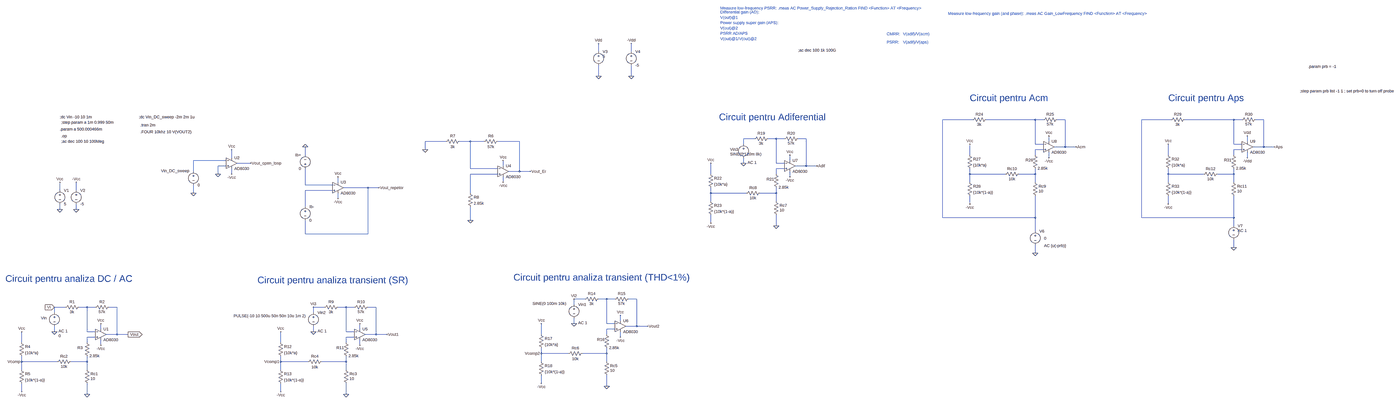
[diagram p0: schematic etaj1_.asc, whole sheet]
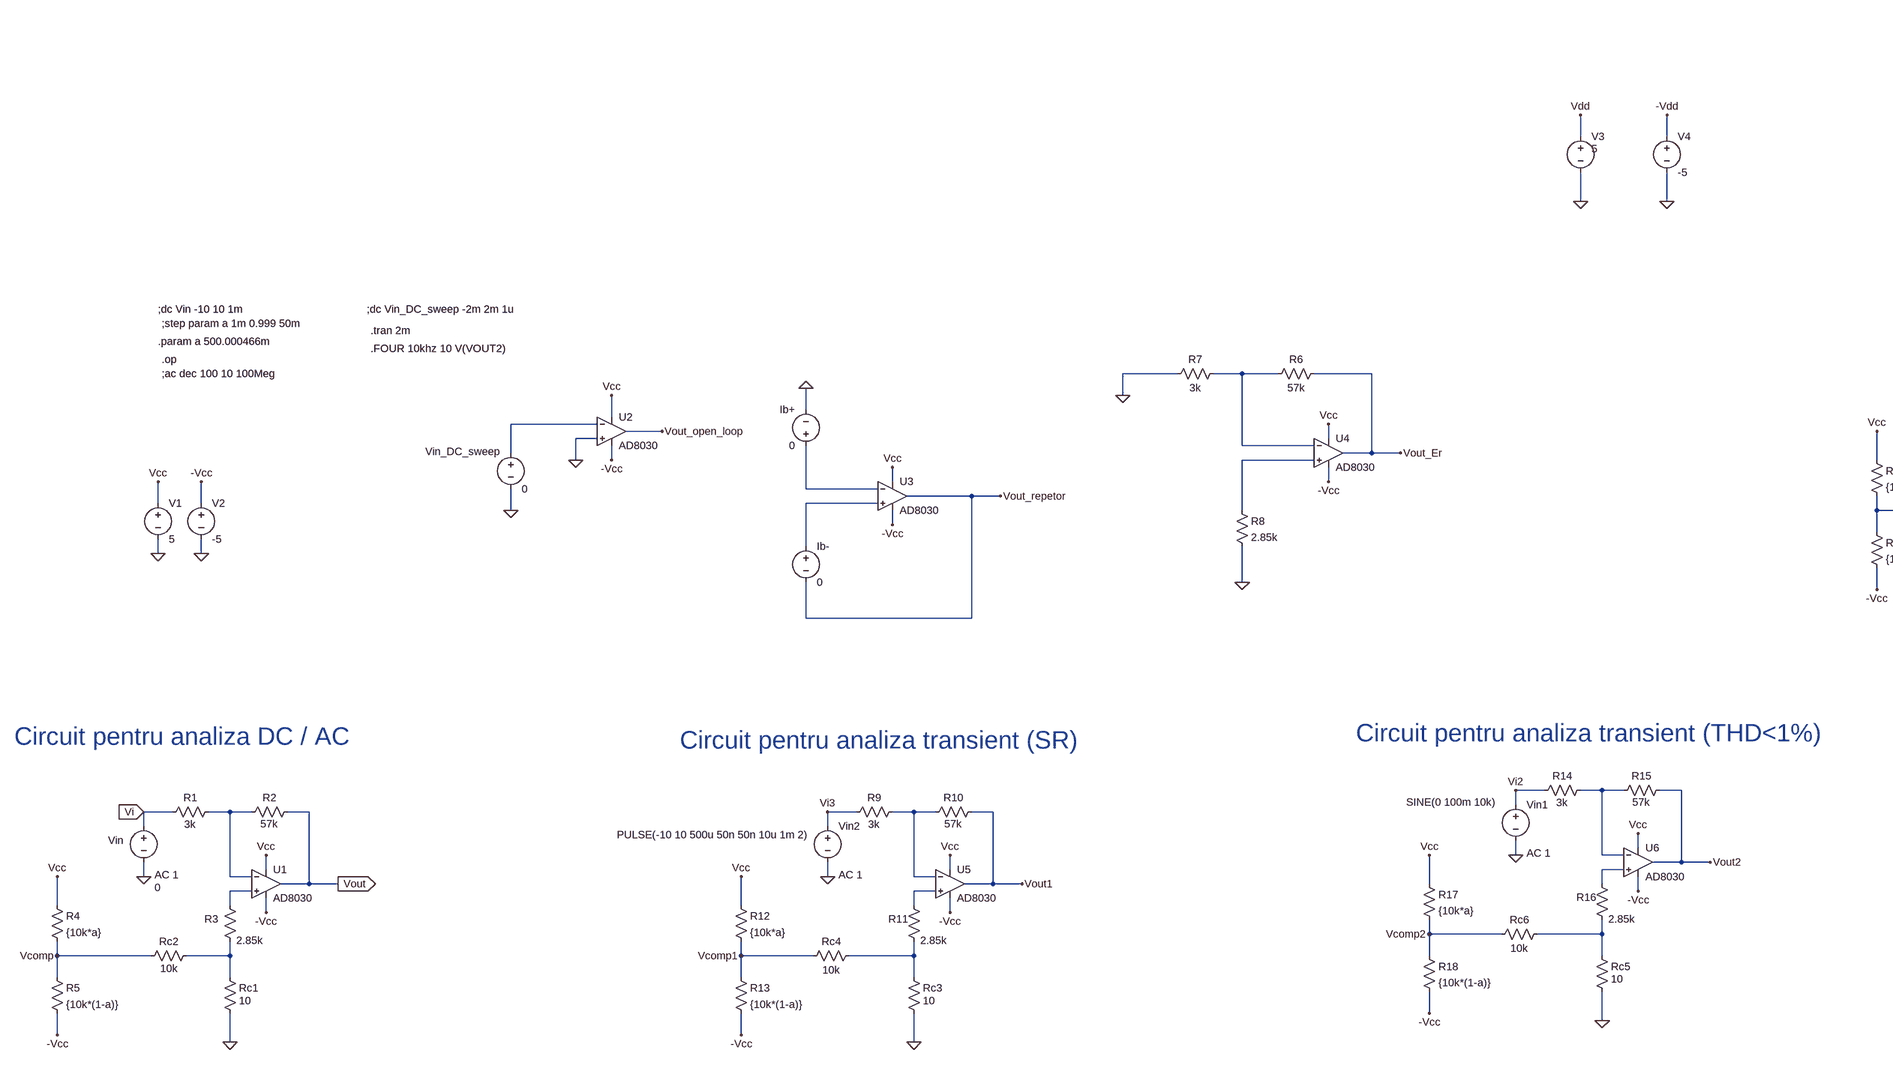
[diagram p1: schematic etaj1_.asc, part, row 1 of 1, column 1 of 2]
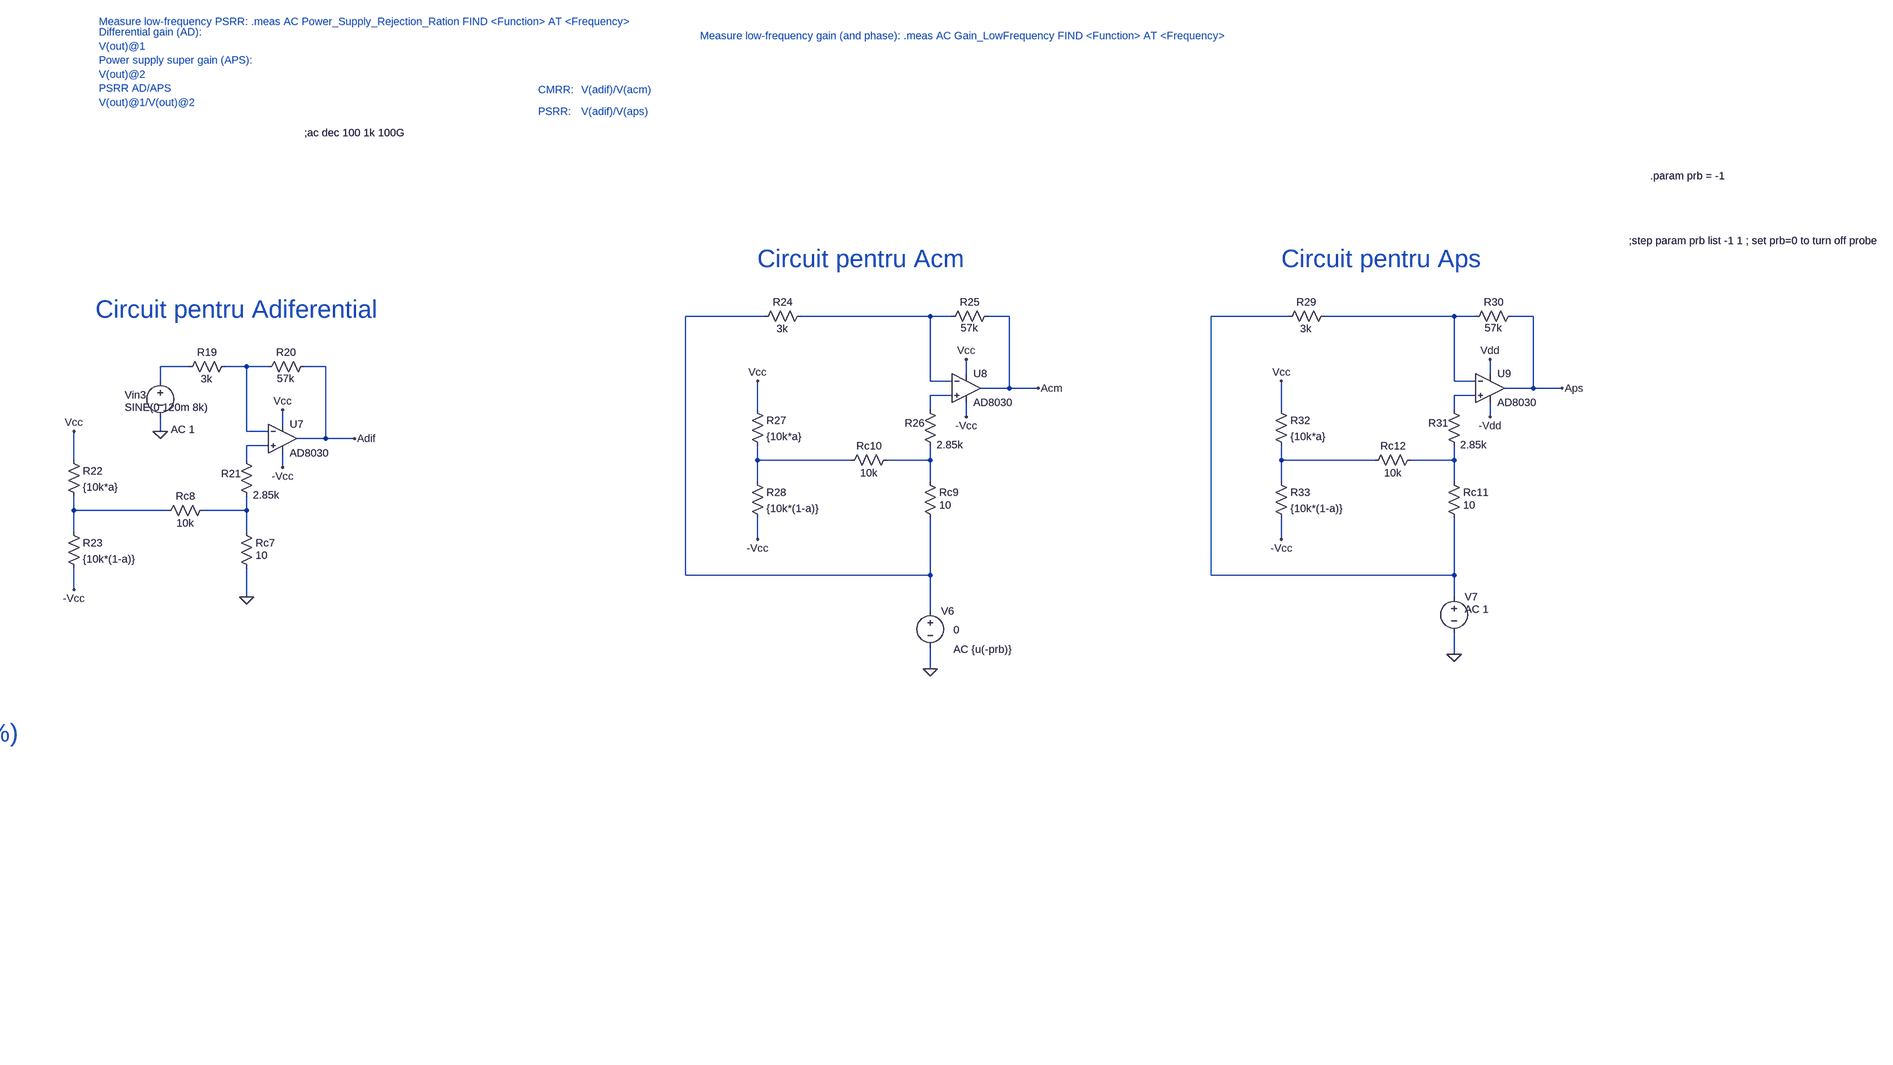
[diagram p2: schematic etaj1_.asc, part, row 1 of 1, column 2 of 2]
etaj1_.asc, the LTspice schematic file:
Version 4
SHEET 1 6668 1776
WIRE 1664 -1232 1664 -1280
WIRE 1856 -1232 1856 -1280
WIRE 1664 -1088 1664 -1152
WIRE 1856 -1088 1856 -1152
WIRE 3872 -832 3696 -832
WIRE 4240 -832 3952 -832
WIRE 4288 -832 4240 -832
WIRE 4416 -832 4368 -832
WIRE 5200 -832 4864 -832
WIRE 5568 -832 5280 -832
WIRE 5616 -832 5568 -832
WIRE 5744 -832 5696 -832
WIRE 2592 -720 2528 -720
WIRE 2720 -720 2672 -720
WIRE 2768 -720 2720 -720
WIRE 2896 -720 2848 -720
WIRE 768 -704 640 -704
WIRE 912 -704 848 -704
WIRE 992 -704 912 -704
WIRE 1200 -704 1072 -704
WIRE 4320 -704 4320 -736
WIRE 5648 -704 5648 -736
WIRE 2528 -688 2528 -720
WIRE 4240 -688 4240 -832
WIRE 4288 -688 4240 -688
WIRE 5568 -688 5568 -832
WIRE 5616 -688 5568 -688
WIRE 4416 -672 4416 -832
WIRE 4416 -672 4352 -672
WIRE 4480 -672 4416 -672
WIRE 5744 -672 5744 -832
WIRE 5744 -672 5680 -672
WIRE 5808 -672 5744 -672
WIRE 640 -656 640 -704
WIRE 4288 -656 4240 -656
WIRE 5616 -656 5568 -656
WIRE -64 -624 -64 -672
WIRE 3856 -624 3856 -688
WIRE 4240 -624 4240 -656
WIRE 5184 -624 5184 -688
WIRE 5568 -624 5568 -656
WIRE -496 -608 -496 -656
WIRE 4320 -608 4320 -640
WIRE 5648 -608 5648 -640
WIRE -528 -592 -720 -592
WIRE 2800 -592 2800 -624
WIRE -384 -576 -464 -576
WIRE 2528 -576 2528 -608
WIRE 2720 -576 2720 -720
WIRE 2768 -576 2720 -576
WIRE -528 -560 -576 -560
WIRE 1104 -560 1104 -592
WIRE 2896 -560 2896 -720
WIRE 2896 -560 2832 -560
WIRE 2960 -560 2896 -560
WIRE 912 -544 912 -704
WIRE 1072 -544 912 -544
WIRE 2768 -544 2720 -544
WIRE -720 -528 -720 -592
WIRE 1200 -528 1200 -704
WIRE 1200 -528 1136 -528
WIRE 1264 -528 1200 -528
WIRE -576 -512 -576 -560
WIRE -496 -512 -496 -544
WIRE 1072 -512 912 -512
WIRE 2336 -512 2336 -576
WIRE 2720 -512 2720 -544
WIRE 3856 -512 3856 -544
WIRE 4064 -512 3856 -512
WIRE 4240 -512 4240 -544
WIRE 4240 -512 4144 -512
WIRE 5184 -512 5184 -544
WIRE 5392 -512 5184 -512
WIRE 5568 -512 5568 -544
WIRE 5568 -512 5472 -512
WIRE 2800 -496 2800 -528
WIRE 128 -464 128 -496
WIRE 1104 -464 1104 -496
WIRE 3856 -464 3856 -512
WIRE 4240 -464 4240 -512
WIRE 5184 -464 5184 -512
WIRE 5568 -464 5568 -512
WIRE -64 -448 -64 -544
WIRE 96 -448 -64 -448
WIRE 304 -432 160 -432
WIRE 368 -432 304 -432
WIRE -1504 -416 -1504 -464
WIRE -1408 -416 -1408 -464
WIRE 96 -416 -64 -416
WIRE -720 -400 -720 -448
WIRE 912 -400 912 -512
WIRE 2336 -400 2336 -432
WIRE 2544 -400 2336 -400
WIRE 2720 -400 2720 -432
WIRE 2720 -400 2624 -400
WIRE 128 -368 128 -400
WIRE 2336 -352 2336 -400
WIRE 2720 -352 2720 -400
WIRE 3856 -336 3856 -384
WIRE 5184 -336 5184 -384
WIRE -64 -320 -64 -416
WIRE -1504 -304 -1504 -336
WIRE -1408 -304 -1408 -336
WIRE 3696 -256 3696 -832
WIRE 4240 -256 4240 -384
WIRE 4240 -256 3696 -256
WIRE 4864 -256 4864 -832
WIRE 5568 -256 5568 -384
WIRE 5568 -256 4864 -256
WIRE 912 -240 912 -320
WIRE 2336 -224 2336 -272
WIRE 2720 -208 2720 -272
WIRE 5568 -208 5568 -256
WIRE 4240 -176 4240 -256
WIRE -64 -160 -64 -240
WIRE 304 -160 304 -432
WIRE 304 -160 -64 -160
WIRE 5568 -80 5568 -128
WIRE 4240 -48 4240 -96
WIRE 1584 256 1520 256
WIRE 1712 256 1664 256
WIRE 1760 256 1712 256
WIRE 1888 256 1840 256
WIRE 1520 288 1520 256
WIRE -1472 304 -1536 304
WIRE -1344 304 -1392 304
WIRE -1296 304 -1344 304
WIRE -1168 304 -1216 304
WIRE 48 304 -16 304
WIRE 176 304 128 304
WIRE 224 304 176 304
WIRE 352 304 304 304
WIRE -1536 336 -1536 304
WIRE -16 336 -16 304
WIRE 1792 384 1792 352
WIRE 1520 400 1520 368
WIRE 1712 400 1712 256
WIRE 1760 400 1712 400
WIRE 1888 416 1888 256
WIRE 1888 416 1824 416
WIRE 1952 416 1888 416
WIRE -1264 432 -1264 400
WIRE 256 432 256 400
WIRE 1760 432 1712 432
WIRE -1536 448 -1536 416
WIRE -1344 448 -1344 304
WIRE -1296 448 -1344 448
WIRE -16 448 -16 416
WIRE 176 448 176 304
WIRE 224 448 176 448
WIRE -1168 464 -1168 304
WIRE -1168 464 -1232 464
WIRE -1104 464 -1168 464
WIRE 352 464 352 304
WIRE 352 464 288 464
WIRE 416 464 352 464
WIRE 1328 464 1328 400
WIRE 1712 464 1712 432
WIRE -1296 480 -1344 480
WIRE 224 480 176 480
WIRE 1792 480 1792 448
WIRE -1728 512 -1728 448
WIRE -1344 512 -1344 480
WIRE -208 512 -208 448
WIRE 176 512 176 480
WIRE -1264 528 -1264 496
WIRE 256 528 256 496
WIRE 1328 576 1328 544
WIRE 1488 576 1328 576
WIRE 1712 576 1712 544
WIRE 1712 576 1568 576
WIRE -1728 624 -1728 592
WIRE -1520 624 -1728 624
WIRE -1344 624 -1344 592
WIRE -1344 624 -1440 624
WIRE -208 624 -208 592
WIRE -48 624 -208 624
WIRE 176 624 176 592
WIRE 176 624 32 624
WIRE 1328 624 1328 576
WIRE 1712 624 1712 576
WIRE -1728 672 -1728 624
WIRE -1344 672 -1344 624
WIRE -208 672 -208 624
WIRE 176 672 176 624
WIRE 1328 752 1328 704
WIRE 1712 768 1712 704
WIRE -1728 800 -1728 752
WIRE -208 800 -208 752
WIRE -1344 816 -1344 752
WIRE 176 816 176 752
FLAG -1344 816 0
FLAG -1536 448 0
FLAG -1504 -304 0
FLAG -1408 -304 0
FLAG -1264 400 Vcc
FLAG -1264 528 -Vcc
FLAG -1504 -464 Vcc
FLAG -1408 -464 -Vcc
FLAG -1728 448 Vcc
FLAG -1728 800 -Vcc
FLAG -1104 464 Vout
IOPIN -1104 464 Out
FLAG -1728 624 Vcomp
FLAG -496 -656 Vcc
FLAG -496 -512 -Vcc
FLAG -384 -576 Vout_open_loop
FLAG -576 -512 0
FLAG -720 -400 0
FLAG 128 -496 Vcc
FLAG 128 -368 -Vcc
FLAG 368 -432 Vout_repetor
FLAG 1104 -592 Vcc
FLAG 1104 -464 -Vcc
FLAG 1264 -528 Vout_Er
FLAG 912 -240 0
FLAG 640 -656 0
FLAG 1712 768 0
FLAG 1520 400 0
FLAG 1792 352 Vcc
FLAG 1792 480 -Vcc
FLAG 1328 400 Vcc
FLAG 1328 752 -Vcc
FLAG 1952 416 Vout2
FLAG 1328 576 Vcomp2
FLAG -1536 304 Vi
IOPIN -1536 304 In
FLAG 1520 256 Vi2
FLAG 176 816 0
FLAG -16 448 0
FLAG 256 400 Vcc
FLAG 256 528 -Vcc
FLAG -208 448 Vcc
FLAG -208 800 -Vcc
FLAG 416 464 Vout1
FLAG -208 624 Vcomp1
FLAG -16 304 Vi3
FLAG -64 -672 0
FLAG 2720 -208 0
FLAG 2528 -576 0
FLAG 2800 -624 Vcc
FLAG 2800 -496 -Vcc
FLAG 2336 -576 Vcc
FLAG 2336 -224 -Vcc
FLAG 2960 -560 Adif
FLAG 1664 -1088 0
FLAG 1856 -1088 0
FLAG 1664 -1280 Vdd
FLAG 1856 -1280 -Vdd
FLAG 4320 -608 -Vcc
FLAG 3856 -688 Vcc
FLAG 3856 -336 -Vcc
FLAG 4480 -672 Acm
FLAG 4240 -48 0
FLAG 5568 -80 0
FLAG 5648 -608 -Vdd
FLAG 5184 -688 Vcc
FLAG 5184 -336 -Vcc
FLAG 5808 -672 Aps
FLAG 5648 -736 Vdd
FLAG 4320 -736 Vcc
DATAFLAG 1520 240 ""
DATAFLAG 1984 416 ""
SYMBOL OpAmps\\AD8030 -1264 400 R0
SYMATTR InstName U1
SYMBOL res -1376 288 R90
WINDOW 0 0 56 VBottom 2
WINDOW 3 59 57 VBottom 2
SYMATTR InstName R1
SYMATTR Value 3k
SYMBOL res -1200 288 R90
WINDOW 0 0 56 VBottom 2
WINDOW 3 58 57 VBottom 2
SYMATTR InstName R2
SYMATTR Value 57k
SYMBOL res -1360 496 R0
WINDOW 0 -41 46 Left 2
WINDOW 3 30 94 Left 2
SYMATTR InstName R3
SYMATTR Value 2.85k
SYMBOL res -1360 656 R0
WINDOW 3 36 68 Left 2
SYMATTR Value 10
SYMATTR InstName Rc1
SYMBOL res -1424 608 R90
WINDOW 0 0 56 VBottom 2
WINDOW 3 60 56 VBottom 2
SYMATTR InstName Rc2
SYMATTR Value 10k
SYMBOL voltage -1536 320 R0
WINDOW 0 -79 47 Left 2
WINDOW 3 24 152 Left 2
WINDOW 123 24 124 Left 2
WINDOW 39 0 0 Left 0
SYMATTR InstName Vin
SYMATTR Value 0
SYMATTR Value2 AC 1
SYMBOL res -1744 496 R0
SYMATTR InstName R4
SYMATTR Value {10k*a}
SYMBOL res -1744 656 R0
SYMATTR InstName R5
SYMATTR Value {10k*(1-a)}
SYMBOL voltage -1504 -432 R0
SYMATTR InstName V1
SYMATTR Value 5
SYMBOL voltage -1408 -432 R0
SYMATTR InstName V2
SYMATTR Value -5
SYMBOL OpAmps\\AD8030 -496 -640 R0
SYMATTR InstName U2
SYMBOL OpAmps\\AD8030 128 -496 R0
SYMATTR InstName U3
SYMBOL OpAmps\\AD8030 1104 -592 R0
SYMATTR InstName U4
SYMBOL voltage -720 -544 R0
WINDOW 0 -190 13 Left 2
WINDOW 123 0 0 Left 0
WINDOW 39 0 0 Left 0
SYMATTR InstName Vin_DC_sweep
SYMATTR Value 0
SYMBOL voltage -64 -336 R0
WINDOW 123 0 0 Left 0
WINDOW 39 0 0 Left 0
SYMATTR InstName Ib-
SYMATTR Value 0
SYMBOL voltage -64 -528 R180
WINDOW 0 24 96 Left 2
WINDOW 3 24 16 Left 2
WINDOW 123 0 0 Left 0
WINDOW 39 0 0 Left 0
SYMATTR InstName Ib+
SYMATTR Value 0
SYMBOL res 1088 -720 R90
WINDOW 0 0 56 VBottom 2
WINDOW 3 32 56 VTop 2
SYMATTR InstName R6
SYMATTR Value 57k
SYMBOL res 864 -720 R90
WINDOW 0 0 56 VBottom 2
WINDOW 3 32 56 VTop 2
SYMATTR InstName R7
SYMATTR Value 3k
SYMBOL res 896 -416 R0
SYMATTR InstName R8
SYMATTR Value 2.85k
SYMBOL OpAmps\\AD8030 1792 352 R0
SYMATTR InstName U6
SYMBOL res 1680 240 R90
WINDOW 0 0 56 VBottom 2
WINDOW 3 59 57 VBottom 2
SYMATTR InstName R14
SYMATTR Value 3k
SYMBOL res 1856 240 R90
WINDOW 0 0 56 VBottom 2
WINDOW 3 58 57 VBottom 2
SYMATTR InstName R15
SYMATTR Value 57k
SYMBOL res 1696 448 R0
WINDOW 0 -41 46 Left 2
WINDOW 3 30 94 Left 2
SYMATTR InstName R16
SYMATTR Value 2.85k
SYMBOL res 1696 608 R0
WINDOW 3 36 68 Left 2
SYMATTR Value 10
SYMATTR InstName Rc5
SYMBOL voltage 1520 272 R0
WINDOW 3 -243 10 Left 2
WINDOW 123 24 124 Left 2
WINDOW 39 0 0 Left 0
SYMATTR Value SINE(0 100m 10k)
SYMATTR Value2 AC 1
SYMATTR InstName Vin1
SYMBOL res 1312 448 R0
SYMATTR InstName R17
SYMATTR Value {10k*a}
SYMBOL res 1312 608 R0
SYMATTR InstName R18
SYMATTR Value {10k*(1-a)}
SYMBOL res 1584 560 R90
WINDOW 0 0 56 VBottom 2
WINDOW 3 32 56 VTop 2
SYMATTR InstName Rc6
SYMATTR Value 10k
SYMBOL OpAmps\\AD8030 256 400 R0
SYMATTR InstName U5
SYMBOL res 144 288 R90
WINDOW 0 0 56 VBottom 2
WINDOW 3 59 57 VBottom 2
SYMATTR InstName R9
SYMATTR Value 3k
SYMBOL res 320 288 R90
WINDOW 0 0 56 VBottom 2
WINDOW 3 58 57 VBottom 2
SYMATTR InstName R10
SYMATTR Value 57k
SYMBOL res 160 496 R0
WINDOW 0 -41 46 Left 2
WINDOW 3 30 94 Left 2
SYMATTR InstName R11
SYMATTR Value 2.85k
SYMBOL res 160 656 R0
WINDOW 3 36 68 Left 2
SYMATTR Value 10
SYMATTR InstName Rc3
SYMBOL voltage -16 320 R0
WINDOW 3 -468 35 Left 2
WINDOW 123 24 124 Left 2
WINDOW 39 0 0 Left 0
SYMATTR Value PULSE(-10 10 500u 50n 50n 10u 1m 2)
SYMATTR Value2 AC 1
SYMATTR InstName Vin2
SYMBOL res -224 496 R0
SYMATTR InstName R12
SYMATTR Value {10k*a}
SYMBOL res -224 656 R0
SYMATTR InstName R13
SYMATTR Value {10k*(1-a)}
SYMBOL res 48 608 R90
WINDOW 0 0 56 VBottom 2
WINDOW 3 32 56 VTop 2
SYMATTR InstName Rc4
SYMATTR Value 10k
SYMBOL OpAmps\\AD8030 2800 -624 R0
SYMATTR InstName U7
SYMBOL res 2688 -736 R90
WINDOW 0 0 56 VBottom 2
WINDOW 3 59 57 VBottom 2
SYMATTR InstName R19
SYMATTR Value 3k
SYMBOL res 2864 -736 R90
WINDOW 0 0 56 VBottom 2
WINDOW 3 58 57 VBottom 2
SYMATTR InstName R20
SYMATTR Value 57k
SYMBOL res 2704 -528 R0
WINDOW 0 -41 46 Left 2
WINDOW 3 30 94 Left 2
SYMATTR InstName R21
SYMATTR Value 2.85k
SYMBOL res 2704 -368 R0
WINDOW 3 36 68 Left 2
SYMATTR Value 10
SYMATTR InstName Rc7
SYMBOL res 2640 -416 R90
WINDOW 0 0 56 VBottom 2
WINDOW 3 60 56 VBottom 2
SYMATTR InstName Rc8
SYMATTR Value 10k
SYMBOL voltage 2528 -704 R0
WINDOW 0 -79 47 Left 2
WINDOW 3 -79 75 Left 2
WINDOW 123 24 124 Left 2
WINDOW 39 0 0 Left 0
SYMATTR InstName Vin3
SYMATTR Value SINE(0 120m 8k)
SYMATTR Value2 AC 1
SYMBOL res 2320 -528 R0
SYMATTR InstName R22
SYMATTR Value {10k*a}
SYMBOL res 2320 -368 R0
SYMATTR InstName R23
SYMATTR Value {10k*(1-a)}
SYMBOL voltage 1664 -1248 R0
WINDOW 3 24 44 Left 2
WINDOW 123 24 72 Left 2
WINDOW 39 0 0 Left 0
SYMATTR Value 5
SYMATTR InstName V3
SYMBOL voltage 1856 -1248 R0
WINDOW 123 0 0 Left 0
WINDOW 39 0 0 Left 0
SYMATTR InstName V4
SYMATTR Value -5
SYMBOL OpAmps\\AD8030 4320 -736 R0
SYMATTR InstName U8
SYMBOL res 3968 -848 R90
WINDOW 0 0 56 VBottom 2
WINDOW 3 59 57 VBottom 2
SYMATTR InstName R24
SYMATTR Value 3k
SYMBOL res 4384 -848 R90
WINDOW 0 0 56 VBottom 2
WINDOW 3 58 57 VBottom 2
SYMATTR InstName R25
SYMATTR Value 57k
SYMBOL res 4224 -640 R0
WINDOW 0 -41 46 Left 2
WINDOW 3 30 94 Left 2
SYMATTR InstName R26
SYMATTR Value 2.85k
SYMBOL res 4224 -480 R0
WINDOW 3 36 68 Left 2
SYMATTR Value 10
SYMATTR InstName Rc9
SYMBOL res 4160 -528 R90
WINDOW 0 0 56 VBottom 2
WINDOW 3 60 56 VBottom 2
SYMATTR InstName Rc10
SYMATTR Value 10k
SYMBOL res 3840 -640 R0
SYMATTR InstName R27
SYMATTR Value {10k*a}
SYMBOL res 3840 -480 R0
SYMATTR InstName R28
SYMATTR Value {10k*(1-a)}
SYMBOL voltage 4240 -192 R0
WINDOW 3 52 58 Left 2
WINDOW 123 52 101 Left 2
WINDOW 39 0 0 Left 0
SYMATTR Value 0
SYMATTR Value2 AC {u(-prb)}
SYMATTR InstName V6
SYMBOL voltage 5568 -224 R0
WINDOW 123 24 44 Left 2
WINDOW 39 0 0 Left 0
WINDOW 3 24 72 Left 2
SYMATTR Value2 AC 1
SYMATTR Value ""
SYMATTR InstName V7
SYMBOL OpAmps\\AD8030 5648 -736 R0
SYMATTR InstName U9
SYMBOL res 5296 -848 R90
WINDOW 0 0 56 VBottom 2
WINDOW 3 59 57 VBottom 2
SYMATTR InstName R29
SYMATTR Value 3k
SYMBOL res 5712 -848 R90
WINDOW 0 0 56 VBottom 2
WINDOW 3 58 57 VBottom 2
SYMATTR InstName R30
SYMATTR Value 57k
SYMBOL res 5552 -640 R0
WINDOW 0 -41 46 Left 2
WINDOW 3 30 94 Left 2
SYMATTR InstName R31
SYMATTR Value 2.85k
SYMBOL res 5552 -480 R0
WINDOW 3 36 68 Left 2
SYMATTR Value 10
SYMATTR InstName Rc11
SYMBOL res 5488 -528 R90
WINDOW 0 0 56 VBottom 2
WINDOW 3 60 56 VBottom 2
SYMATTR InstName Rc12
SYMATTR Value 10k
SYMBOL res 5168 -640 R0
SYMATTR InstName R32
SYMATTR Value {10k*a}
SYMBOL res 5168 -480 R0
SYMATTR InstName R33
SYMATTR Value {10k*(1-a)}
TEXT -1504 -848 Left 2 !;dc Vin -10 10 1m
TEXT -1496 -736 Left 2 !.op
TEXT -1496 -816 Left 2 !;step param a 1m 0.999 50m
TEXT -1504 -776 Left 2 !.param a 500.000466m
TEXT -1496 -704 Left 2 !;ac dec 100 10 100Meg
TEXT -1040 -848 Left 2 !;dc Vin_DC_sweep -2m 2m 1u
TEXT -1032 -800 Left 2 !.tran 2m
TEXT -1032 -760 Left 2 !.FOUR 10khz 10 V(VOUT2)
TEXT 1688 128 Center 5 ;Circuit pentru analiza transient (THD<1%)
TEXT -1448 136 Center 5 ;Circuit pentru analiza DC / AC
TEXT -344 144 Left 5 ;Circuit pentru analiza transient (SR)
TEXT 2384 -848 Left 5 ;Circuit pentru Adiferential
TEXT 2392 -1464 Left 2 ;Differential gain (AD):\nV(out)@1\nPower supply super gain (APS):\nV(out)@2\nPSRR AD/APS\nV(out)@1/V(out)@2
TEXT 3728 -1456 Left 2 ;Measure low-frequency gain (and phase): .meas AC Gain_LowFrequency FIND <Function> AT <Frequency>
TEXT 2848 -1240 Left 2 !;ac dec 100 1k 100G
TEXT 3856 -960 Left 5 ;Circuit pentru Acm
TEXT 2392 -1488 Left 2 ;Measure low-frequency PSRR: .meas AC Power_Supply_Rejection_Ration FIND <Function> AT <Frequency>
TEXT 5184 -960 Left 5 ;Circuit pentru Aps
TEXT 3464 -1288 Left 2 ;V(adif)/V(aps)
TEXT 3368 -1336 Left 2 ;CMRR:
TEXT 3368 -1288 Left 2 ;PSRR:
TEXT 3464 -1336 Left 2 ;V(adif)/V(acm)
TEXT 6096 -1144 Left 2 !.param prb = -1
TEXT 6048 -1000 Left 2 !;step param prb list -1 1 ; set prb=0 to turn off probe

The netlist it stands for:
* etaj1_.asc
XU1 N025 N022 Vcc -Vcc Vout AD8040  ; AD8030, pins In+ In- V+ V- OUT
R1 N022 Vi 3k
R2 Vout N022 57k
R3 N025 N028 2.85k
Rc1 N028 0 10
Rc2 N028 Vcomp 10k
Vin Vi 0 0 AC 1
R4 Vcc Vcomp {10k*a}
R5 Vcomp -Vcc {10k*(1-a)}
V1 Vcc 0 5
V2 -Vcc 0 -5
XU2 0 N010 Vcc -Vcc Vout_open_loop AD8040  ; AD8030, pins In+ In- V+ V- OUT
XU3 N018 N017 Vcc -Vcc Vout_repetor AD8040  ; AD8030, pins In+ In- V+ V- OUT
XU4 N012 N007 Vcc -Vcc Vout_Er AD8040  ; AD8030, pins In+ In- V+ V- OUT
Vin_DC_sweep N010 0 0
V§Ib- N018 Vout_repetor 0
V§Ib+ N017 0 0
R6 Vout_Er N007 57k
R7 N007 0 3k
R8 N012 0 2.85k
XU6 N024 N021 Vcc -Vcc Vout2 AD8040  ; AD8030, pins In+ In- V+ V- OUT
R14 N021 Vi2 3k
R15 Vout2 N021 57k
R16 N024 N027 2.85k
Rc5 N027 0 10
Vin1 Vi2 0 SINE(0 100m 10k) AC 1
R17 Vcc Vcomp2 {10k*a}
R18 Vcomp2 -Vcc {10k*(1-a)}
Rc6 N027 Vcomp2 10k
XU5 N026 N023 Vcc -Vcc Vout1 AD8040  ; AD8030, pins In+ In- V+ V- OUT
R9 N023 Vi3 3k
R10 Vout1 N023 57k
R11 N026 N029 2.85k
Rc3 N029 0 10
Vin2 Vi3 0 PULSE(-10 10 500u 50n 50n 10u 1m 2) AC 1
R12 Vcc Vcomp1 {10k*a}
R13 Vcomp1 -Vcc {10k*(1-a)}
Rc4 N029 Vcomp1 10k
XU7 N011 N006 Vcc -Vcc Adif AD8040  ; AD8030, pins In+ In- V+ V- OUT
R19 N006 N005 3k
R20 Adif N006 57k
R21 N011 N020 2.85k
Rc7 N020 0 10
Rc8 N020 N019 10k
Vin3 N005 0 SINE(0 120m 8k) AC 1
R22 Vcc N019 {10k*a}
R23 N019 -Vcc {10k*(1-a)}
V3 Vdd 0 5
V4 -Vdd 0 -5
XU8 N008 N002 Vcc -Vcc Acm AD8040  ; AD8030, pins In+ In- V+ V- OUT
R24 N002 N001 3k
R25 Acm N002 57k
R26 N008 N014 2.85k
Rc9 N014 N001 10
Rc10 N014 N013 10k
R27 Vcc N013 {10k*a}
R28 N013 -Vcc {10k*(1-a)}
V6 N001 0 0 AC {u(-prb)}
V7 N003 0 AC 1
XU9 N009 N004 Vdd -Vdd Aps AD8040  ; AD8030, pins In+ In- V+ V- OUT
R29 N004 N003 3k
R30 Aps N004 57k
R31 N009 N016 2.85k
Rc11 N016 N003 10
Rc12 N016 N015 10k
R32 Vcc N015 {10k*a}
R33 N015 -Vcc {10k*(1-a)}
;dc Vin -10 10 1m
.op
;step param a 1m 0.999 50m
.param a 500.000466m
;ac dec 100 10 100Meg
;dc Vin_DC_sweep -2m 2m 1u
.tran 2m
.FOUR 10khz 10 V(VOUT2)
* Circuit pentru analiza transient (THD<1%)
* Circuit pentru analiza DC / AC
* Circuit pentru analiza transient (SR)
* Circuit pentru Adiferential
* Differential gain (AD):
* V(out)@1
* Power supply super gain (APS):
* V(out)@2
* PSRR AD/APS
* V(out)@1/V(out)@2
* Measure low-frequency gain (and phase): .meas AC Gain_LowFrequency FIND <Function> AT <Frequency>
;ac dec 100 1k 100G
* Circuit pentru Acm
* Measure low-frequency PSRR: .meas AC Power_Supply_Rejection_Ration FIND <Function> AT <Frequency>
* Circuit pentru Aps
* V(adif)/V(aps)
* CMRR:
* PSRR:
* V(adif)/V(acm)
.param prb = -1
;step param prb list -1 1 ; set prb=0 to turn off probe
.lib ADI.lib
.backanno
.end